# Altium schematic sheet SBUS.SchDoc
size A4
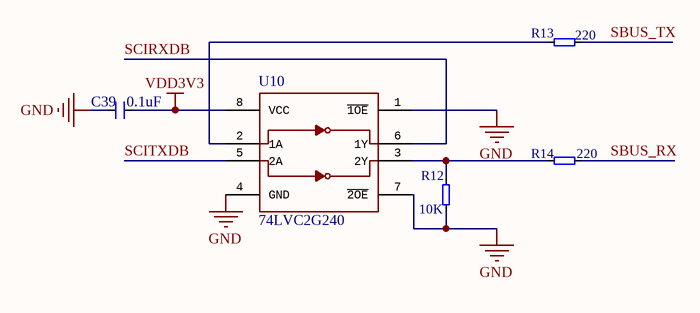
[diagram p0: SBUS.SchDoc]

## Parts
C39  0.1uF  [0603C]
R12  10K  [0603R]
R13  220  [0603R]
R14  220  [0603R]
U10  74LVC2G240  [VSSOP8-0.5]

## Nets
GND: C39.2 R12.2 U10.1(~{1OE}) U10.4(GND) U10.7(~{2OE})
VDD3V3: C39.1 U10.8(VCC)
SBUS_RX: R14.1
SBUS_TX: R13.1
SCIRXDB: U10.6(1Y)
SCITXDB: U10.5(2A)
NetR12_1: R12.1 R14.2 U10.3(2Y)
NetR13_2: R13.2 U10.2(1A)

## Library data of the parts
C39 = C
R12-R14 = R